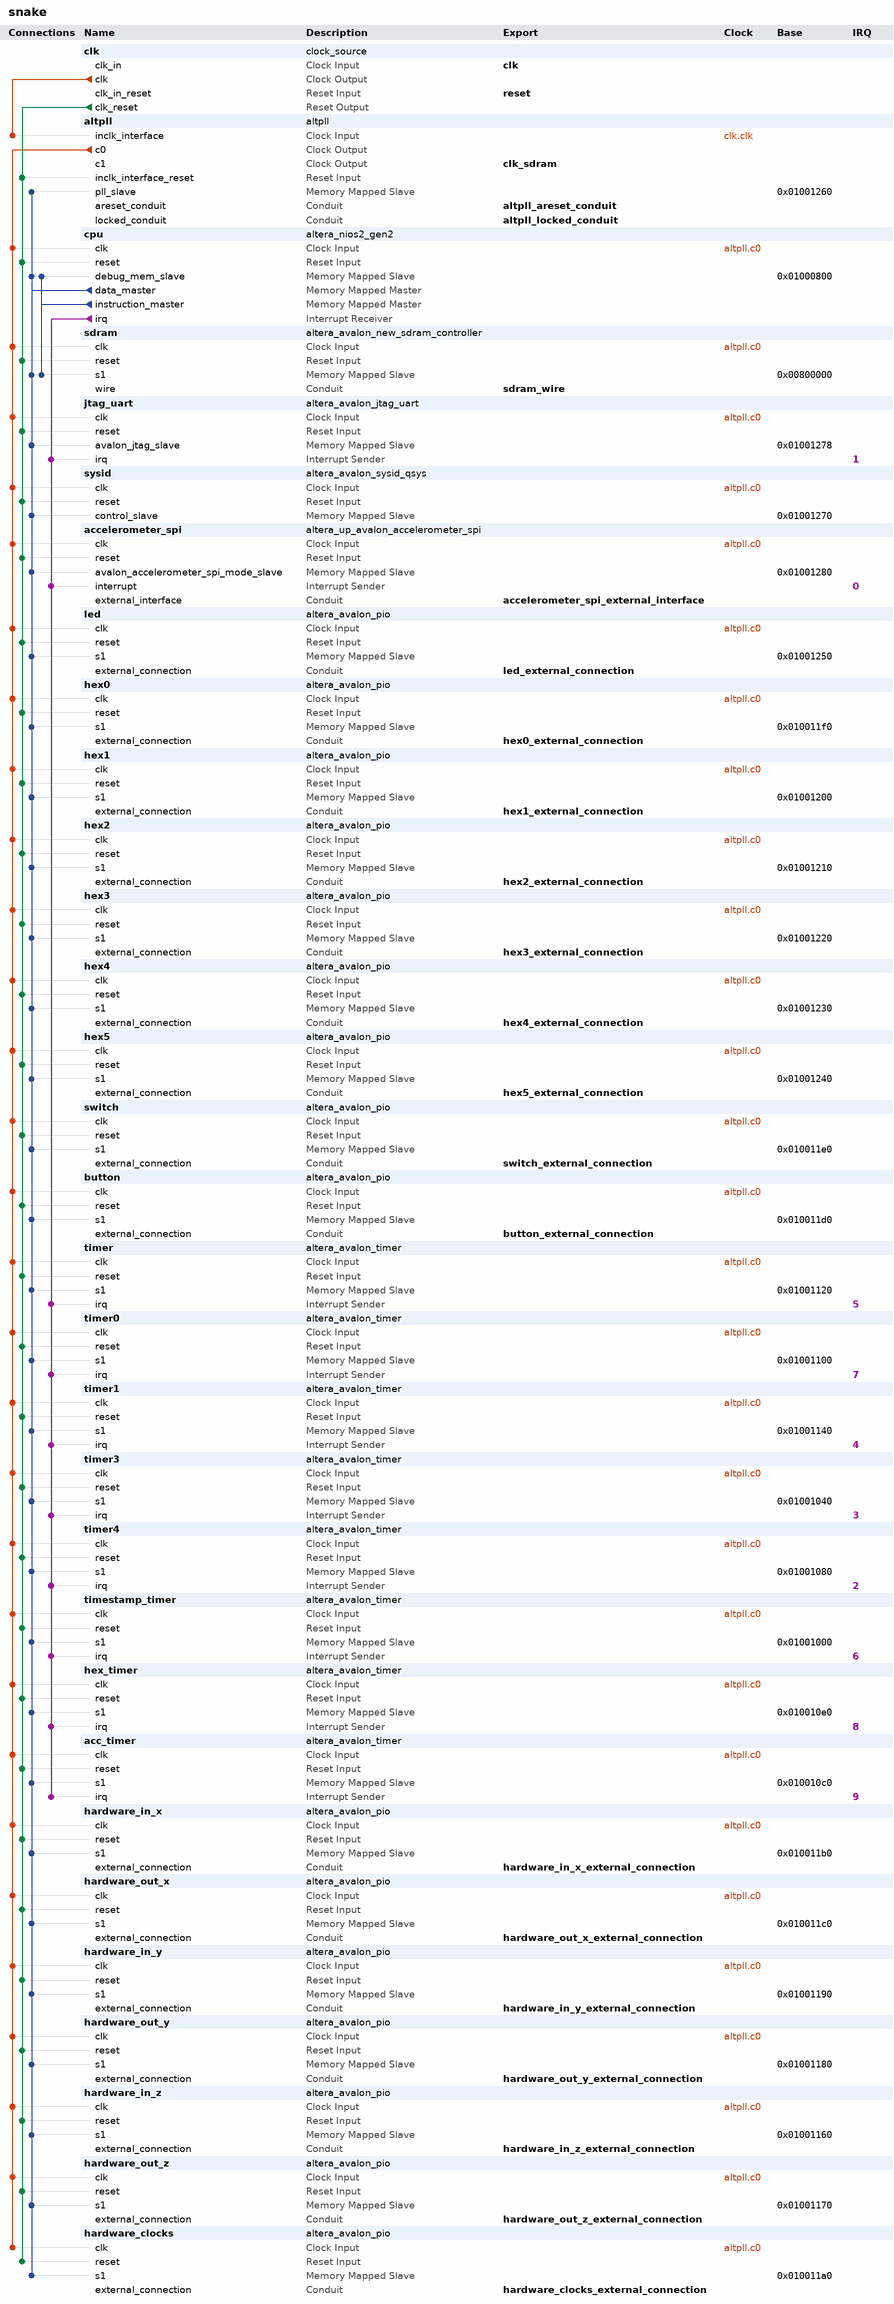
[diagram p0: system contents]
# Platform Designer (Qsys) system snake, MAX 10 10M50DAF484C6GES
# Parameters at their usual value, and those the tool derives, are not listed.
package require -exact qsys 18.1
create_system snake
set_project_property DEVICE_FAMILY {MAX 10}
set_project_property DEVICE 10M50DAF484C6GES

add_instance clk clock_source 18.1
set_instance_parameter_value clk clockFrequency 50000000

add_instance altpll altpll 18.1
set_instance_parameter_value altpll CLK0_DIVIDE_BY 5
set_instance_parameter_value altpll CLK0_MULTIPLY_BY 12
set_instance_parameter_value altpll CLK1_DIVIDE_BY 5
set_instance_parameter_value altpll CLK1_DUTY_CYCLE 50
set_instance_parameter_value altpll CLK1_MULTIPLY_BY 12
set_instance_parameter_value altpll CLK1_PHASE_SHIFT -3000
set_instance_parameter_value altpll INCLK0_INPUT_FREQUENCY 20000
set_instance_parameter_value altpll PORT_ARESET PORT_USED
set_instance_parameter_value altpll PORT_LOCKED PORT_USED
set_instance_parameter_value altpll PORT_clk1 PORT_USED
set_instance_parameter_value altpll PORT_clk2 PORT_UNUSED
set_instance_parameter_value altpll PORT_clk3 PORT_UNUSED

add_instance cpu altera_nios2_gen2 18.1
set_instance_parameter_value cpu dcache_size 2048
set_instance_parameter_value cpu exceptionSlave sdram.s1
set_instance_parameter_value cpu icache_size 4096
set_instance_parameter_value cpu impl Tiny
set_instance_parameter_value cpu resetSlave sdram.s1

add_instance sdram altera_avalon_new_sdram_controller 18.1
set_instance_parameter_value sdram TAC 5.5
set_instance_parameter_value sdram TRCD 20.0
set_instance_parameter_value sdram TRP 20.0
set_instance_parameter_value sdram casLatency 3
set_instance_parameter_value sdram columnWidth 8
set_instance_parameter_value sdram dataWidth 16
set_instance_parameter_value sdram generateSimulationModel false
set_instance_parameter_value sdram model single_Micron_MT48LC4M32B2_7_chip
set_instance_parameter_value sdram numberOfBanks 4
set_instance_parameter_value sdram numberOfChipSelects 1
set_instance_parameter_value sdram powerUpDelay 100.0
set_instance_parameter_value sdram refreshPeriod 15.625
set_instance_parameter_value sdram rowWidth 12

add_instance jtag_uart altera_avalon_jtag_uart 18.1
set_instance_parameter_value jtag_uart simInteractiveOptions NO_INTERACTIVE_WINDOWS

add_instance sysid altera_avalon_sysid_qsys 18.1
set_instance_parameter_value sysid id 0

add_instance accelerometer_spi altera_up_avalon_accelerometer_spi 18.0

add_instance led altera_avalon_pio 18.1
set_instance_parameter_value led direction Output
set_instance_parameter_value led width 10

add_instance hex0 altera_avalon_pio 18.1
set_instance_parameter_value hex0 direction Output
set_instance_parameter_value hex0 resetValue 137
set_instance_parameter_value hex0 width 8

add_instance hex1 altera_avalon_pio 18.1
set_instance_parameter_value hex1 direction Output
set_instance_parameter_value hex1 resetValue 146
set_instance_parameter_value hex1 width 8

add_instance hex2 altera_avalon_pio 18.1
set_instance_parameter_value hex2 direction Output
set_instance_parameter_value hex2 resetValue 136
set_instance_parameter_value hex2 width 8

add_instance hex3 altera_avalon_pio 18.1
set_instance_parameter_value hex3 direction Output
set_instance_parameter_value hex3 resetValue 199
set_instance_parameter_value hex3 width 8

add_instance hex4 altera_avalon_pio 18.1
set_instance_parameter_value hex4 direction Output
set_instance_parameter_value hex4 resetValue 142
set_instance_parameter_value hex4 width 8

add_instance hex5 altera_avalon_pio 18.1
set_instance_parameter_value hex5 direction Output
set_instance_parameter_value hex5 resetValue 255
set_instance_parameter_value hex5 width 8

add_instance switch altera_avalon_pio 18.1
set_instance_parameter_value switch direction Input
set_instance_parameter_value switch width 10

add_instance button altera_avalon_pio 18.1
set_instance_parameter_value button direction Input
set_instance_parameter_value button width 2

add_instance timer altera_avalon_timer 18.1
set_instance_parameter_value timer period 1
set_instance_parameter_value timer periodUnits MSEC

add_instance timer0 altera_avalon_timer 18.1
set_instance_parameter_value timer0 period 1
set_instance_parameter_value timer0 periodUnits MSEC

add_instance timer1 altera_avalon_timer 18.1
set_instance_parameter_value timer1 period 1
set_instance_parameter_value timer1 periodUnits MSEC

add_instance timer3 altera_avalon_timer 18.1
set_instance_parameter_value timer3 counterSize 64
set_instance_parameter_value timer3 period 1
set_instance_parameter_value timer3 periodUnits MSEC

add_instance timer4 altera_avalon_timer 18.1
set_instance_parameter_value timer4 counterSize 64
set_instance_parameter_value timer4 period 1
set_instance_parameter_value timer4 periodUnits MSEC

add_instance timestamp_timer altera_avalon_timer 18.1
set_instance_parameter_value timestamp_timer counterSize 64
set_instance_parameter_value timestamp_timer period 1
set_instance_parameter_value timestamp_timer periodUnits MSEC

add_instance hex_timer altera_avalon_timer 18.1
set_instance_parameter_value hex_timer period 1
set_instance_parameter_value hex_timer periodUnits MSEC

add_instance acc_timer altera_avalon_timer 18.1
set_instance_parameter_value acc_timer period 1
set_instance_parameter_value acc_timer periodUnits MSEC

add_instance hardware_in_x altera_avalon_pio 18.1
set_instance_parameter_value hardware_in_x direction Input
set_instance_parameter_value hardware_in_x width 31

add_instance hardware_out_x altera_avalon_pio 18.1
set_instance_parameter_value hardware_out_x direction Output
set_instance_parameter_value hardware_out_x width 31

add_instance hardware_in_y altera_avalon_pio 18.1
set_instance_parameter_value hardware_in_y direction Input
set_instance_parameter_value hardware_in_y width 31

add_instance hardware_out_y altera_avalon_pio 18.1
set_instance_parameter_value hardware_out_y direction Output
set_instance_parameter_value hardware_out_y width 31

add_instance hardware_in_z altera_avalon_pio 18.1
set_instance_parameter_value hardware_in_z direction Input
set_instance_parameter_value hardware_in_z width 31

add_instance hardware_out_z altera_avalon_pio 18.1
set_instance_parameter_value hardware_out_z direction Output
set_instance_parameter_value hardware_out_z width 31

add_instance hardware_clocks altera_avalon_pio 18.1
set_instance_parameter_value hardware_clocks direction Output
set_instance_parameter_value hardware_clocks width 4

# connections
add_connection altpll.c0 acc_timer.clk clock
add_connection altpll.c0 accelerometer_spi.clk clock
add_connection altpll.c0 button.clk clock
add_connection altpll.c0 cpu.clk clock
add_connection altpll.c0 hardware_clocks.clk clock
add_connection altpll.c0 hardware_in_x.clk clock
add_connection altpll.c0 hardware_in_y.clk clock
add_connection altpll.c0 hardware_in_z.clk clock
add_connection altpll.c0 hardware_out_x.clk clock
add_connection altpll.c0 hardware_out_y.clk clock
add_connection altpll.c0 hardware_out_z.clk clock
add_connection altpll.c0 hex0.clk clock
add_connection altpll.c0 hex1.clk clock
add_connection altpll.c0 hex2.clk clock
add_connection altpll.c0 hex3.clk clock
add_connection altpll.c0 hex4.clk clock
add_connection altpll.c0 hex5.clk clock
add_connection altpll.c0 hex_timer.clk clock
add_connection altpll.c0 jtag_uart.clk clock
add_connection altpll.c0 led.clk clock
add_connection altpll.c0 sdram.clk clock
add_connection altpll.c0 switch.clk clock
add_connection altpll.c0 sysid.clk clock
add_connection altpll.c0 timer0.clk clock
add_connection altpll.c0 timer1.clk clock
add_connection altpll.c0 timer3.clk clock
add_connection altpll.c0 timer4.clk clock
add_connection altpll.c0 timer.clk clock
add_connection altpll.c0 timestamp_timer.clk clock
add_connection clk.clk altpll.inclk_interface clock
add_connection clk.clk_reset acc_timer.reset reset
add_connection clk.clk_reset accelerometer_spi.reset reset
add_connection clk.clk_reset altpll.inclk_interface_reset reset
add_connection clk.clk_reset button.reset reset
add_connection clk.clk_reset cpu.reset reset
add_connection clk.clk_reset hardware_clocks.reset reset
add_connection clk.clk_reset hardware_in_x.reset reset
add_connection clk.clk_reset hardware_in_y.reset reset
add_connection clk.clk_reset hardware_in_z.reset reset
add_connection clk.clk_reset hardware_out_x.reset reset
add_connection clk.clk_reset hardware_out_y.reset reset
add_connection clk.clk_reset hardware_out_z.reset reset
add_connection clk.clk_reset hex0.reset reset
add_connection clk.clk_reset hex1.reset reset
add_connection clk.clk_reset hex2.reset reset
add_connection clk.clk_reset hex3.reset reset
add_connection clk.clk_reset hex4.reset reset
add_connection clk.clk_reset hex5.reset reset
add_connection clk.clk_reset hex_timer.reset reset
add_connection clk.clk_reset jtag_uart.reset reset
add_connection clk.clk_reset led.reset reset
add_connection clk.clk_reset sdram.reset reset
add_connection clk.clk_reset switch.reset reset
add_connection clk.clk_reset sysid.reset reset
add_connection clk.clk_reset timer0.reset reset
add_connection clk.clk_reset timer1.reset reset
add_connection clk.clk_reset timer3.reset reset
add_connection clk.clk_reset timer4.reset reset
add_connection clk.clk_reset timer.reset reset
add_connection clk.clk_reset timestamp_timer.reset reset
add_connection cpu.data_master acc_timer.s1 avalon
set_connection_parameter_value cpu.data_master/acc_timer.s1 baseAddress 0x010010c0
add_connection cpu.data_master accelerometer_spi.avalon_accelerometer_spi_mode_slave avalon
set_connection_parameter_value cpu.data_master/accelerometer_spi.avalon_accelerometer_spi_mode_slave baseAddress 0x01001280
add_connection cpu.data_master altpll.pll_slave avalon
set_connection_parameter_value cpu.data_master/altpll.pll_slave baseAddress 0x01001260
add_connection cpu.data_master button.s1 avalon
set_connection_parameter_value cpu.data_master/button.s1 baseAddress 0x010011d0
add_connection cpu.data_master cpu.debug_mem_slave avalon
set_connection_parameter_value cpu.data_master/cpu.debug_mem_slave baseAddress 0x01000800
add_connection cpu.data_master hardware_clocks.s1 avalon
set_connection_parameter_value cpu.data_master/hardware_clocks.s1 baseAddress 0x010011a0
add_connection cpu.data_master hardware_in_x.s1 avalon
set_connection_parameter_value cpu.data_master/hardware_in_x.s1 baseAddress 0x010011b0
add_connection cpu.data_master hardware_in_y.s1 avalon
set_connection_parameter_value cpu.data_master/hardware_in_y.s1 baseAddress 0x01001190
add_connection cpu.data_master hardware_in_z.s1 avalon
set_connection_parameter_value cpu.data_master/hardware_in_z.s1 baseAddress 0x01001160
add_connection cpu.data_master hardware_out_x.s1 avalon
set_connection_parameter_value cpu.data_master/hardware_out_x.s1 baseAddress 0x010011c0
add_connection cpu.data_master hardware_out_y.s1 avalon
set_connection_parameter_value cpu.data_master/hardware_out_y.s1 baseAddress 0x01001180
add_connection cpu.data_master hardware_out_z.s1 avalon
set_connection_parameter_value cpu.data_master/hardware_out_z.s1 baseAddress 0x01001170
add_connection cpu.data_master hex0.s1 avalon
set_connection_parameter_value cpu.data_master/hex0.s1 baseAddress 0x010011f0
add_connection cpu.data_master hex1.s1 avalon
set_connection_parameter_value cpu.data_master/hex1.s1 baseAddress 0x01001200
add_connection cpu.data_master hex2.s1 avalon
set_connection_parameter_value cpu.data_master/hex2.s1 baseAddress 0x01001210
add_connection cpu.data_master hex3.s1 avalon
set_connection_parameter_value cpu.data_master/hex3.s1 baseAddress 0x01001220
add_connection cpu.data_master hex4.s1 avalon
set_connection_parameter_value cpu.data_master/hex4.s1 baseAddress 0x01001230
add_connection cpu.data_master hex5.s1 avalon
set_connection_parameter_value cpu.data_master/hex5.s1 baseAddress 0x01001240
add_connection cpu.data_master hex_timer.s1 avalon
set_connection_parameter_value cpu.data_master/hex_timer.s1 baseAddress 0x010010e0
add_connection cpu.data_master jtag_uart.avalon_jtag_slave avalon
set_connection_parameter_value cpu.data_master/jtag_uart.avalon_jtag_slave baseAddress 0x01001278
add_connection cpu.data_master led.s1 avalon
set_connection_parameter_value cpu.data_master/led.s1 baseAddress 0x01001250
add_connection cpu.data_master sdram.s1 avalon
set_connection_parameter_value cpu.data_master/sdram.s1 baseAddress 0x00800000
add_connection cpu.data_master switch.s1 avalon
set_connection_parameter_value cpu.data_master/switch.s1 baseAddress 0x010011e0
add_connection cpu.data_master sysid.control_slave avalon
set_connection_parameter_value cpu.data_master/sysid.control_slave baseAddress 0x01001270
add_connection cpu.data_master timer0.s1 avalon
set_connection_parameter_value cpu.data_master/timer0.s1 baseAddress 0x01001100
add_connection cpu.data_master timer1.s1 avalon
set_connection_parameter_value cpu.data_master/timer1.s1 baseAddress 0x01001140
add_connection cpu.data_master timer3.s1 avalon
set_connection_parameter_value cpu.data_master/timer3.s1 baseAddress 0x01001040
add_connection cpu.data_master timer4.s1 avalon
set_connection_parameter_value cpu.data_master/timer4.s1 baseAddress 0x01001080
add_connection cpu.data_master timer.s1 avalon
set_connection_parameter_value cpu.data_master/timer.s1 baseAddress 0x01001120
add_connection cpu.data_master timestamp_timer.s1 avalon
set_connection_parameter_value cpu.data_master/timestamp_timer.s1 baseAddress 0x01001000
add_connection cpu.instruction_master cpu.debug_mem_slave avalon
set_connection_parameter_value cpu.instruction_master/cpu.debug_mem_slave baseAddress 0x01000800
add_connection cpu.instruction_master sdram.s1 avalon
set_connection_parameter_value cpu.instruction_master/sdram.s1 baseAddress 0x00800000
add_connection cpu.irq acc_timer.irq interrupt
set_connection_parameter_value cpu.irq/acc_timer.irq irqNumber 9
add_connection cpu.irq accelerometer_spi.interrupt interrupt
set_connection_parameter_value cpu.irq/accelerometer_spi.interrupt irqNumber 0
add_connection cpu.irq hex_timer.irq interrupt
set_connection_parameter_value cpu.irq/hex_timer.irq irqNumber 8
add_connection cpu.irq jtag_uart.irq interrupt
set_connection_parameter_value cpu.irq/jtag_uart.irq irqNumber 1
add_connection cpu.irq timer0.irq interrupt
set_connection_parameter_value cpu.irq/timer0.irq irqNumber 7
add_connection cpu.irq timer1.irq interrupt
set_connection_parameter_value cpu.irq/timer1.irq irqNumber 4
add_connection cpu.irq timer3.irq interrupt
set_connection_parameter_value cpu.irq/timer3.irq irqNumber 3
add_connection cpu.irq timer4.irq interrupt
set_connection_parameter_value cpu.irq/timer4.irq irqNumber 2
add_connection cpu.irq timer.irq interrupt
set_connection_parameter_value cpu.irq/timer.irq irqNumber 5
add_connection cpu.irq timestamp_timer.irq interrupt
set_connection_parameter_value cpu.irq/timestamp_timer.irq irqNumber 6

# exported interfaces
add_interface accelerometer_spi_external_interface conduit end
set_interface_property accelerometer_spi_external_interface EXPORT_OF accelerometer_spi.external_interface
add_interface altpll_areset_conduit conduit end
set_interface_property altpll_areset_conduit EXPORT_OF altpll.areset_conduit
add_interface altpll_locked_conduit conduit end
set_interface_property altpll_locked_conduit EXPORT_OF altpll.locked_conduit
add_interface button_external_connection conduit end
set_interface_property button_external_connection EXPORT_OF button.external_connection
add_interface clk clock sink
set_interface_property clk EXPORT_OF clk.clk_in
add_interface clk_sdram clock source
set_interface_property clk_sdram EXPORT_OF altpll.c1
add_interface hardware_clocks_external_connection conduit end
set_interface_property hardware_clocks_external_connection EXPORT_OF hardware_clocks.external_connection
add_interface hardware_in_x_external_connection conduit end
set_interface_property hardware_in_x_external_connection EXPORT_OF hardware_in_x.external_connection
add_interface hardware_in_y_external_connection conduit end
set_interface_property hardware_in_y_external_connection EXPORT_OF hardware_in_y.external_connection
add_interface hardware_in_z_external_connection conduit end
set_interface_property hardware_in_z_external_connection EXPORT_OF hardware_in_z.external_connection
add_interface hardware_out_x_external_connection conduit end
set_interface_property hardware_out_x_external_connection EXPORT_OF hardware_out_x.external_connection
add_interface hardware_out_y_external_connection conduit end
set_interface_property hardware_out_y_external_connection EXPORT_OF hardware_out_y.external_connection
add_interface hardware_out_z_external_connection conduit end
set_interface_property hardware_out_z_external_connection EXPORT_OF hardware_out_z.external_connection
add_interface hex0_external_connection conduit end
set_interface_property hex0_external_connection EXPORT_OF hex0.external_connection
add_interface hex1_external_connection conduit end
set_interface_property hex1_external_connection EXPORT_OF hex1.external_connection
add_interface hex2_external_connection conduit end
set_interface_property hex2_external_connection EXPORT_OF hex2.external_connection
add_interface hex3_external_connection conduit end
set_interface_property hex3_external_connection EXPORT_OF hex3.external_connection
add_interface hex4_external_connection conduit end
set_interface_property hex4_external_connection EXPORT_OF hex4.external_connection
add_interface hex5_external_connection conduit end
set_interface_property hex5_external_connection EXPORT_OF hex5.external_connection
add_interface led_external_connection conduit end
set_interface_property led_external_connection EXPORT_OF led.external_connection
add_interface reset reset sink
set_interface_property reset EXPORT_OF clk.clk_in_reset
add_interface sdram_wire conduit end
set_interface_property sdram_wire EXPORT_OF sdram.wire
add_interface switch_external_connection conduit end
set_interface_property switch_external_connection EXPORT_OF switch.external_connection

set_interconnect_requirement {$system} qsys_mm.clockCrossingAdapter HANDSHAKE
set_interconnect_requirement {$system} qsys_mm.enableEccProtection FALSE
set_interconnect_requirement {$system} qsys_mm.insertDefaultSlave FALSE
set_interconnect_requirement {$system} qsys_mm.maxAdditionalLatency 1

save_system snake.qsys
